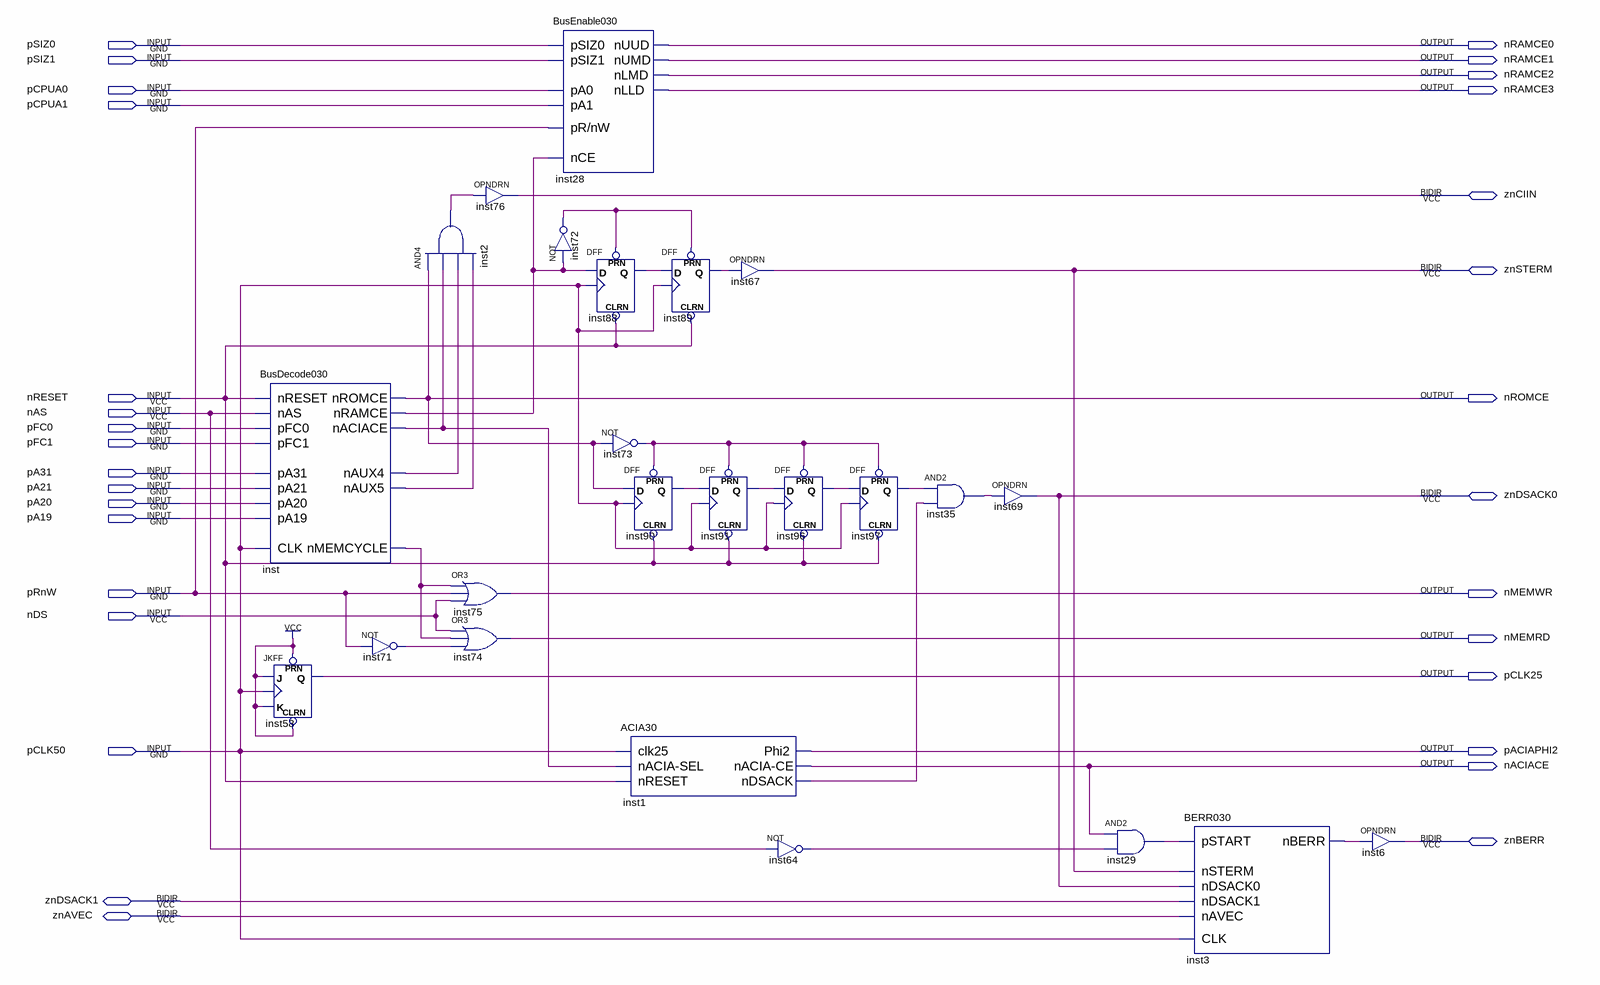
[diagram p0: schematic sheet]
// Quartus schematic wrap030.bdf as structural Verilog: 24 symbols, 31 pins
module wrap030 (
  input  pSIZ0,
  input  pSIZ1,
  input  pCPUA0,
  input  pCPUA1,
  input  nRESET,
  input  nAS,
  input  pFC0,
  input  pFC1,
  input  pA31,
  input  pA21,
  input  pA20,
  input  pA19,
  input  pRnW,
  input  nDS,
  input  pCLK50,
  inout  znCIIN,
  inout  znSTERM,
  inout  znDSACK0,
  inout  znBERR,
  inout  znDSACK1,
  inout  znAVEC,
  output nRAMCE0,
  output nRAMCE1,
  output nRAMCE2,
  output nRAMCE3,
  output nROMCE,
  output nMEMWR,
  output nMEMRD,
  output pCLK25,
  output pACIAPHI2,
  output nACIACE
);

  wire inst1_ndsack, inst2_out, inst3_nberr, inst29_out, inst35_out, inst64_out, inst71_out, inst72_out,
       inst73_out, inst88_q, inst89_q, inst90_q, inst91_q, inst96_q, inst97_q, inst_naciace, inst_naux4,
       inst_naux5, inst_nmemcycle, inst_nramce;

  BusDecode030 inst (
    .nRESET(nRESET), .nAS(nAS), .pFC0(pFC0), .pFC1(pFC1), .pA31(pA31), .pA21(pA21), .pA20(pA20), .pA19(pA19),
    .CLK(pCLK50), .nROMCE(nROMCE), .nRAMCE(inst_nramce), .nACIACE(inst_naciace), .nAUX4(inst_naux4),
    .nAUX5(inst_naux5), .nMEMCYCLE(inst_nmemcycle));
  JKFF inst58 (.PRN(1'b1), .CLRN(1'b1), .K(1'b1), .J(1'b1), .CLK(pCLK50), .Q(pCLK25));
  not inst71 (inst71_out, pRnW);
  and inst2 (inst2_out, nROMCE, inst_naciace, inst_naux4, inst_naux5);
  or inst75 (nMEMWR, inst_nmemcycle, pRnW, nDS);
  or inst74 (nMEMRD, nDS, inst_nmemcycle, inst71_out);
  OPNDRN inst76 (.IN(inst2_out), .OUT(znCIIN));
  BusEnable030 inst28 (
    .pSIZ1(pSIZ1), .pSIZ0(pSIZ0), .pA0(pCPUA0), .pA1(pCPUA1), .\pR/nW (pRnW), .nCE(inst_nramce),
    .nUUD(nRAMCE0), .nUMD(nRAMCE1), .nLMD(nRAMCE2), .nLLD(nRAMCE3));
  not inst72 (inst72_out, inst_nramce);
  DFF inst88 (.CLRN(nRESET), .CLK(pCLK50), .D(inst_nramce), .PRN(inst72_out), .Q(inst88_q));
  not inst73 (inst73_out, nROMCE);
  DFF inst90 (.CLRN(nRESET), .CLK(pCLK50), .D(nROMCE), .PRN(inst73_out), .Q(inst90_q));
  ACIA30 inst1 (
    .clk25(pCLK50), .\nACIA-SEL (inst_naciace), .nRESET(nRESET), .Phi2(pACIAPHI2), .\nACIA-CE (nACIACE),
    .nDSACK(inst1_ndsack));
  DFF inst89 (.CLRN(nRESET), .CLK(pCLK50), .D(inst88_q), .PRN(inst72_out), .Q(inst89_q));
  DFF inst91 (.CLRN(nRESET), .CLK(pCLK50), .D(inst90_q), .PRN(inst73_out), .Q(inst91_q));
  OPNDRN inst67 (.IN(inst89_q), .OUT(znSTERM));
  DFF inst96 (.CLRN(nRESET), .CLK(pCLK50), .D(inst91_q), .PRN(inst73_out), .Q(inst96_q));
  not inst64 (inst64_out, nAS);
  DFF inst97 (.CLRN(nRESET), .CLK(pCLK50), .D(inst96_q), .PRN(inst73_out), .Q(inst97_q));
  and inst35 (inst35_out, inst97_q, inst1_ndsack);
  OPNDRN inst69 (.IN(inst35_out), .OUT(znDSACK0));
  and inst29 (inst29_out, nACIACE, inst64_out);
  BERR030 inst3 (
    .nSTERM(znSTERM), .nDSACK0(znDSACK0), .nDSACK1(znDSACK1), .nAVEC(znAVEC), .pSTART(inst29_out),
    .CLK(pCLK50), .nBERR(inst3_nberr));
  OPNDRN inst6 (.IN(inst3_nberr), .OUT(znBERR));
endmodule
